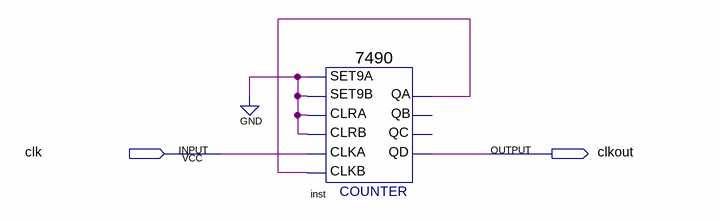
[diagram p0: schematic sheet]
// Quartus schematic clk10.bdf as structural Verilog: 1 symbols, 2 pins
module clk10 (
  input  clk,
  output clkout
);

  wire inst_qa;

  \7490  inst (
    .SET9A(1'b0), .CLRA(1'b0), .SET9B(1'b0), .CLKB(inst_qa), .CLKA(clk), .CLRB(1'b0), .QD(clkout),
    .QA(inst_qa));  // open: QB, QC
endmodule
